# Altium project DIOT_tester.PrjPCB (part 3 of 3)

## Sheet LED_bargraph.SchDoc: LED
size 420 x 297 mm; Author: G.Kasprowicz; CompanyName: WUT ISE; DrawnBy: G.Kasprowicz; Organization: WUT ISE; Address1: PW ISE; Address2: Nowowiejska 15/19 00-665 Warsaw; Address3: gkasprow@gmail.com; Revision: 2; SheetNumber: -; SheetTotal: -; ModifiedBy: -; CheckedDate: -; Title2: Bargraph; DivGrp: WUT ISE; Designer: G.Kasprowicz; ModifiedDate: -; ProjectName: Sensor Box
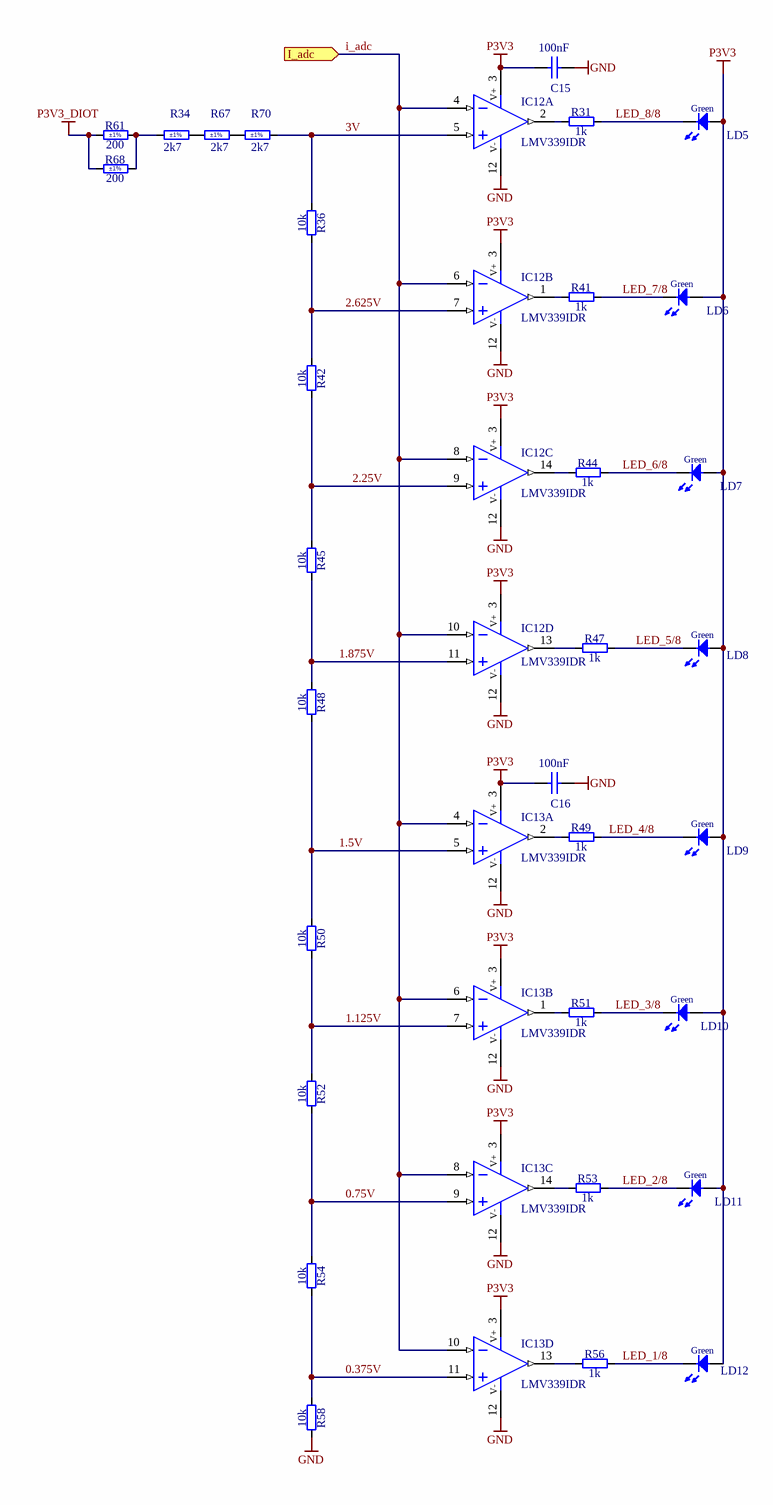
[diagram p6: LED_bargraph.SchDoc]

### Parts
C15  100nF  [CAPC1005X55N]
C16  100nF  [CAPC1005X55N]
IC12  LMV339IDR  [SOIC127P600X175-14N]  (parts A,B,C,D of 4)
IC13  LMV339IDR  [SOIC127P600X175-14N]  (parts A,B,C,D of 4)
LD5  Green  [LED_AVAGO_HSME-C120]
LD6  Green  [LED_AVAGO_HSME-C120]
LD7  Green  [LED_AVAGO_HSME-C120]
LD8  Green  [LED_AVAGO_HSME-C120]
LD9  Green  [LED_AVAGO_HSME-C120]
LD10  Green  [LED_AVAGO_HSME-C120]
LD11  Green  [LED_AVAGO_HSME-C120]
LD12  Green  [LED_AVAGO_HSME-C120]
R31  1k  [RESC1608X55N]
R34  2k7  Tolerance: ±1%  [RESC1608X55N]
R36  10k  [RESC1005X40N]
R41  1k  [RESC1608X55N]
R42  10k  [RESC1005X40N]
R44  1k  [RESC1608X55N]
R45  10k  [RESC1005X40N]
R47  1k  [RESC1608X55N]
R48  10k  [RESC1005X40N]
R49  1k  [RESC1608X55N]
R50  10k  [RESC1005X40N]
R51  1k  [RESC1608X55N]
R52  10k  [RESC1005X40N]
R53  1k  [RESC1608X55N]
R54  10k  [RESC1005X40N]
R56  1k  [RESC1608X55N]
R58  10k  [RESC1005X40N]
R61  200  Tolerance: ±1%  [RESC1005X40N]
R67  2k7  Tolerance: ±1%  [RESC1608X55N]
R68  200  Tolerance: ±1%  [RESC1005X40N]
R70  2k7  Tolerance: ±1%  [RESC1608X55N]

### Ports
I_adc (in)

### Nets
GND: C15.1 C16.1 IC12.12(V-) IC13.12(V-) R58.2
P3V3: C15.2 C16.2 IC12.3(V+) IC13.3(V+) LD5.2(A) LD6.2(A) LD7.2(A) LD8.2(A) LD9.2(A) LD10.2(A) LD11.2(A) LD12.2(A)
P3V3_DIOT: R61.1 R68.1
0.75V: IC13.9(IN+) R52.2 R54.1
0.375V: IC13.11(IN+) R54.2 R58.1
1.5V: IC13.5(IN+) R48.2 R50.1
1.125V: IC13.7(IN+) R50.2 R52.1
1.875V: IC12.11(IN+) R45.2 R48.1
2.25V: IC12.9(IN+) R42.2 R45.1
2.625V: IC12.7(IN+) R36.2 R42.1
3V: IC12.5(IN+) R36.1 R70.2
i_adc: IC12.4(IN-) IC12.6(IN-) IC12.8(IN-) IC12.10(IN-) IC13.4(IN-) IC13.6(IN-) IC13.8(IN-) IC13.10(IN-) ; port I_adc
LED_1/8: LD12.1(C) R56.2
LED_2/8: LD11.1(C) R53.2
LED_3/8: LD10.1(C) R51.2
LED_4/8: LD9.1(C) R49.2
LED_5/8: LD8.1(C) R47.2
LED_6/8: LD7.1(C) R44.2
LED_7/8: LD6.1(C) R41.2
LED_8/8: LD5.1(C) R31.2
NetIC12_1: IC12.1(OUT) R41.1
NetIC12_2: IC12.2(OUT) R31.1
NetIC12_13: IC12.13(OUT) R47.1
NetIC12_14: IC12.14(OUT) R44.1
NetIC13_1: IC13.1(OUT) R51.1
NetIC13_2: IC13.2(OUT) R49.1
NetIC13_13: IC13.13(OUT) R56.1
NetIC13_14: IC13.14(OUT) R53.1
NetR34_1: R34.1 R61.2 R68.2
NetR34_2: R34.2 R67.1
NetR67_2: R67.2 R70.1

### Notes on the sheet
- Project/Equipment
- Document
- Designer
- Drawn by
- Check.by
- Contact
- File
- Last Mod.
- Print Date
- Sheet
- Size
- A3
- of
- Rev
- Copyright WUT 2021.
  This document describes Open Hardware and is licensed under the CERN-OHL-W v2
  You may redistribute and modify this documentation and make products using it under the terms of the CERN-OHL-W v2 (https:/cern.ch/cern-ohl). This documentation is distributed WITHOUT ANY EXPRESS OR IMPLIED WARRANTY, INCLUDING OF MERCHANTABILITY, SATISFACTORY QUALITY AND FITNESS FOR A PARTICULAR PURPOSE. Please see the CERN-OHL-W v2 for applicable conditions.
  As per CERN-OHL-W v2 section 4, should You produce hardware based
  on these sources, You must maintain the Source Location visible on the
  silkscreen or top copper for a  product you make using this documentation..

### Library data of the parts
C15 C16 = CC0402_100NF_50V_10%_X7R: Non-polarised capacitor; Part Description: SMD Multilayer Chip Ceramic Capacitor; Manufacturer: GENERIC; Manufacturer1 Part Number: GRM155R71H104KE14D; Voltage: 50V; TC: X7R; Tolerance: ±10%; Part Number: CC0402_100NF_50V_10%_X7R; Component Kind: Standard; Component Type: Standard; Pin Count: 2; Value: 100nF; Status: None; Manufacturer Part Number: CC0402_100NF_50V_10%_X7R; Case: 0402; Mounted: Yes; Socket: No; SMD: Yes; Sense: No; HelpURL: \\cern.ch\dfs\Applications\Altium\Datasheets\CC0402_MURATA_GRM155R71H104KE14D.pdf; Author: CERN DEM MR; CreateDate: 30.06.2017; LatestRevisionDate: 30.06.2017; Manufacturer1 Example: MURATA; Manufacturer1 ComponentHeight: 0.55mm
IC12 IC13 = CMP_LMV339: Quad Differential Rail to Rail Comparator; Manufacturer: TEXAS INSTRUMENTS; PressFit: No; Bonding: No; Part Number: LMV339IDR; Component Kind: Standard; Component Type: Standard; Device: LMV339IDR; PackageDescription: SOIC 14, Pitch 1.27mm - Body 4x8.75mm, IPC Medium Density; Part Description: Quad Differential Rail to Rail Comparator; Manufacturer Part Number: LMV339IDR; Pin Count: 14; Case: SOIC14; Mounted: Yes; Socket: No; SMD: Yes; Sense: No; ComponentHeight: 1.75mm; Author: GK; HelpURL: \\cern.ch\dfs\Applications\Altium\Datasheets\LM339AD.pdf; CreateDate: 09.03.2011; LatestRevisionDate: 09.03.2011
LD5-LD12 = LED_AVAGO_HSME-C120: LED Green 1C 2A; Part Description: High Performance Right Angle Chip Green LED; Manufacturer: AVAGO TECHNOLOGIES; PressFit: No; Bonding: No; Part Number: LED_AVAGO_HSME-C120; Component Kind: Standard; Component Type: Standard; Color: Green; PackageDescription: Green Chip LED, 2-Leads, Body 1.7x1.1mm, Side Emitting Package; Manufacturer Part Number: HSME-C120; Pin Count: 2; Mounted: Yes; Socket: No; SMD: Yes; Sense: No; ComponentHeight: 0.7mm; HelpURL: \\cern.ch\dfs\Applications\Altium\Datasheets\LED_AVAGO_HSME-C120.pdf; ComponentLink1URL: \\cern.ch\dfs\Applications\Altium\Datasheets\LED_AVAGO_HSME-C110_DESIGN-GUIDE.pdf; ComponentLink1Description: Design Guide; Author: CERN DEM JMW; CreateDate: 22.07.2009; LatestRevisionDate: 20.06.2012
R31 R41 R44 R47 R49 R51 R53 R56 = R0603_1K_1%_0.1W_100PPM: Resistor - 1%; Part Description: General Purpose Thick Film Chip Resistor; Manufacturer: GENERIC; Manufacturer1 Part Number: NRC06F1001TRF; Power: 0.1W; TC: ±100ppm/°C; PressFit: No; Part Number: R0603_1K_1%_0.1W_100PPM; Component Kind: Standard; Component Type: Standard; Pin Count: 2; Value: 1k; Status: Preferred; Tolerance: ±1%; Manufacturer Part Number: R0603_1K_1%_0.1W_100PPM; Case: 0603; Mounted: Yes; Sense: No; Socket: No; SMD: Yes; Manufacturer1 Example: NIC COMPONENT; Manufacturer1 ComponentHeight: 0.55mm; HelpURL: \\cern.ch\dfs\Applications\Altium\Datasheets\R0603_NIC_NRC.pdf; Author: CERN DEM JLC; CreateDate: 03.12.2007; LatestRevisionDate: 13.03.2008
R34 R67 R70 = R0603_2K7_1%_0.1W_100PPM: Resistor - 1%; Part Description: General Purpose Thick Film Chip Resistor; Manufacturer: GENERIC; Manufacturer1 Part Number: RC0603FR-072K7L; Power: 0.1W; TC: ±100ppm/°C; PressFit: No; Part Number: R0603_2K7_1%_0.1W_100PPM; Component Kind: Standard; Component Type: Standard; Pin Count: 2; Value: 2k7; Status: Preferred; Manufacturer Part Number: R0603_2K7_1%_0.1W_100PPM; Case: 0603; Mounted: Yes; Sense: No; Socket: No; SMD: Yes; Manufacturer1 Example: YAGEO PHYCOMP; Manufacturer1 ComponentHeight: 0.55mm; HelpURL: \\cern.ch\dfs\Applications\Altium\Datasheets\R0603_PHYCOMP_RC0603.pdf; Author: CERN DEM JLC; CreateDate: 02.05.2011; LatestRevisionDate: 02.05.2011
R36 R42 R45 R48 R50 R52 R54 R58 = R0402_10K_1%_0.0625W_100PPM: Resistor - 1%; Part Description: General Purpose Thick Film Chip Resistor; Manufacturer: GENERIC; Manufacturer1 Part Number: 232270671003L; TC: ±100ppm/°C; PressFit: No; Part Number: R0402_10K_1%_0.0625W_100PPM; Component Kind: Standard; Component Type: Standard; Pin Count: 2; Value: 10k; Status: Not Recommended; Power: 0.0625W; Tolerance: ±1%; Manufacturer Part Number: R0402_10K_1%_0.0625W_100PPM; Case: 0402; Mounted: Yes; Sense: No; Socket: No; SMD: Yes; Manufacturer1 Example: YAGEO PHYCOMP; Manufacturer1 ComponentHeight: 0.4mm; HelpURL: \\cern.ch\dfs\Applications\Altium\Datasheets\R0402_Phycomp_RC0402.pdf; Author: CERN DEM JLC; CreateDate: 03.12.2007; LatestRevisionDate: 17.10.2012
R61 R68 = R0402_200R_1%_0.0625W_100PPM: Resistor - 1%; Part Description: General Purpose Thick Film Chip Resistor; Manufacturer: GENERIC; Manufacturer1 Part Number: 232270672001L; TC: ±100ppm/°C; PressFit: No; Part Number: R0402_200R_1%_0.0625W_100PPM; Component Kind: Standard; Component Type: Standard; Pin Count: 2; Value: 200; Status: Not Recommended; Power: 0.0625W; Manufacturer Part Number: R0402_200R_1%_0.0625W_100PPM; Case: 0402; Mounted: Yes; Sense: No; Socket: No; SMD: Yes; Manufacturer1 Example: YAGEO PHYCOMP; Manufacturer1 ComponentHeight: 0.4mm; HelpURL: \\cern.ch\dfs\Applications\Altium\Datasheets\R0402_Phycomp_RC0402.pdf; Author: CERN DEM JLC; CreateDate: 03.12.2007; LatestRevisionDate: 17.10.2012

## Sheet USB_ISOL.SchDoc: Isolated
size 420 x 297 mm; SPICEModelCacheMEOSHKXJ: <root> / <DocumentId>MEOSHKXJ</DocumentId> / <CacheFrame Number="0"> / <Model Name="pk14" Kind="CKT"> / <Text>*.INC dhvqfn.s / .SUBCKT pk14 / +    1   2   3   4   5   6   7   8   9  10 / +   11  12  13  14 / +   15  16  17  18  19  20  21  22  23  24 / +   25  26  27  28 / * Pin Resistance / r1 1 1001 9.078E-02 / r2 2 1002 8.829E-02 / r3 3 1003 8.731E-02 / r4 4 1004 8.710E-02 / r5 5 1005 8.731E-02 / r6 6 1006 8.829E-02 / r7 7 1007 9.075E-02 / r8 8 1008 9.072E-02 / r9 9 1009 8.809E-02 / r10 10 1010 8.716E-02 / r11 11 1011 8.706E-02 / r12 12 1012 8.720E-02 / r13 13 1013 8.816E-02 / r14 14 1014 9.068E-02 / * Pin Inductance / l1 1001 15 2.981E-09 / l2 1002 16 2.447E-09 / l3 1003 17 2.304E-09 / l4 1004 18 2.291E-09 / l5 1005 19 2.307E-09 / l6 1006 20 2.449E-09 / l7 1007 21 2.971E-09 / l8 1008 22 2.972E-09 / l9 1009 23 2.425E-09 / l10 1010 24 2.286E-09 / l11 1011 25 2.280E-09 / l12 1012 26 2.286E-09 / l13 1013 27 2.425E-09 / l14 1014 28 2.975E-09 / .ENDS pk14</Text> / </Model> / </CacheFrame> / </root>; Author: G.Kasprowicz; CompanyName: WUT ISE; DrawnBy: G.Kasprowicz; Organization: WUT ISE; Address1: PW ISE; Address2: Nowowiejska 15/19 00-665 Warsaw; Address3: gkasprow@gmail.com; Revision: 2; SheetNumber: -; SheetTotal: -; ModifiedBy: -; CheckedDate: -; Title2: USB to I2C interface; DivGrp: WUT ISE; Designer: G.Kasprowicz; ModifiedDate: -; ProjectName: Sensor Box
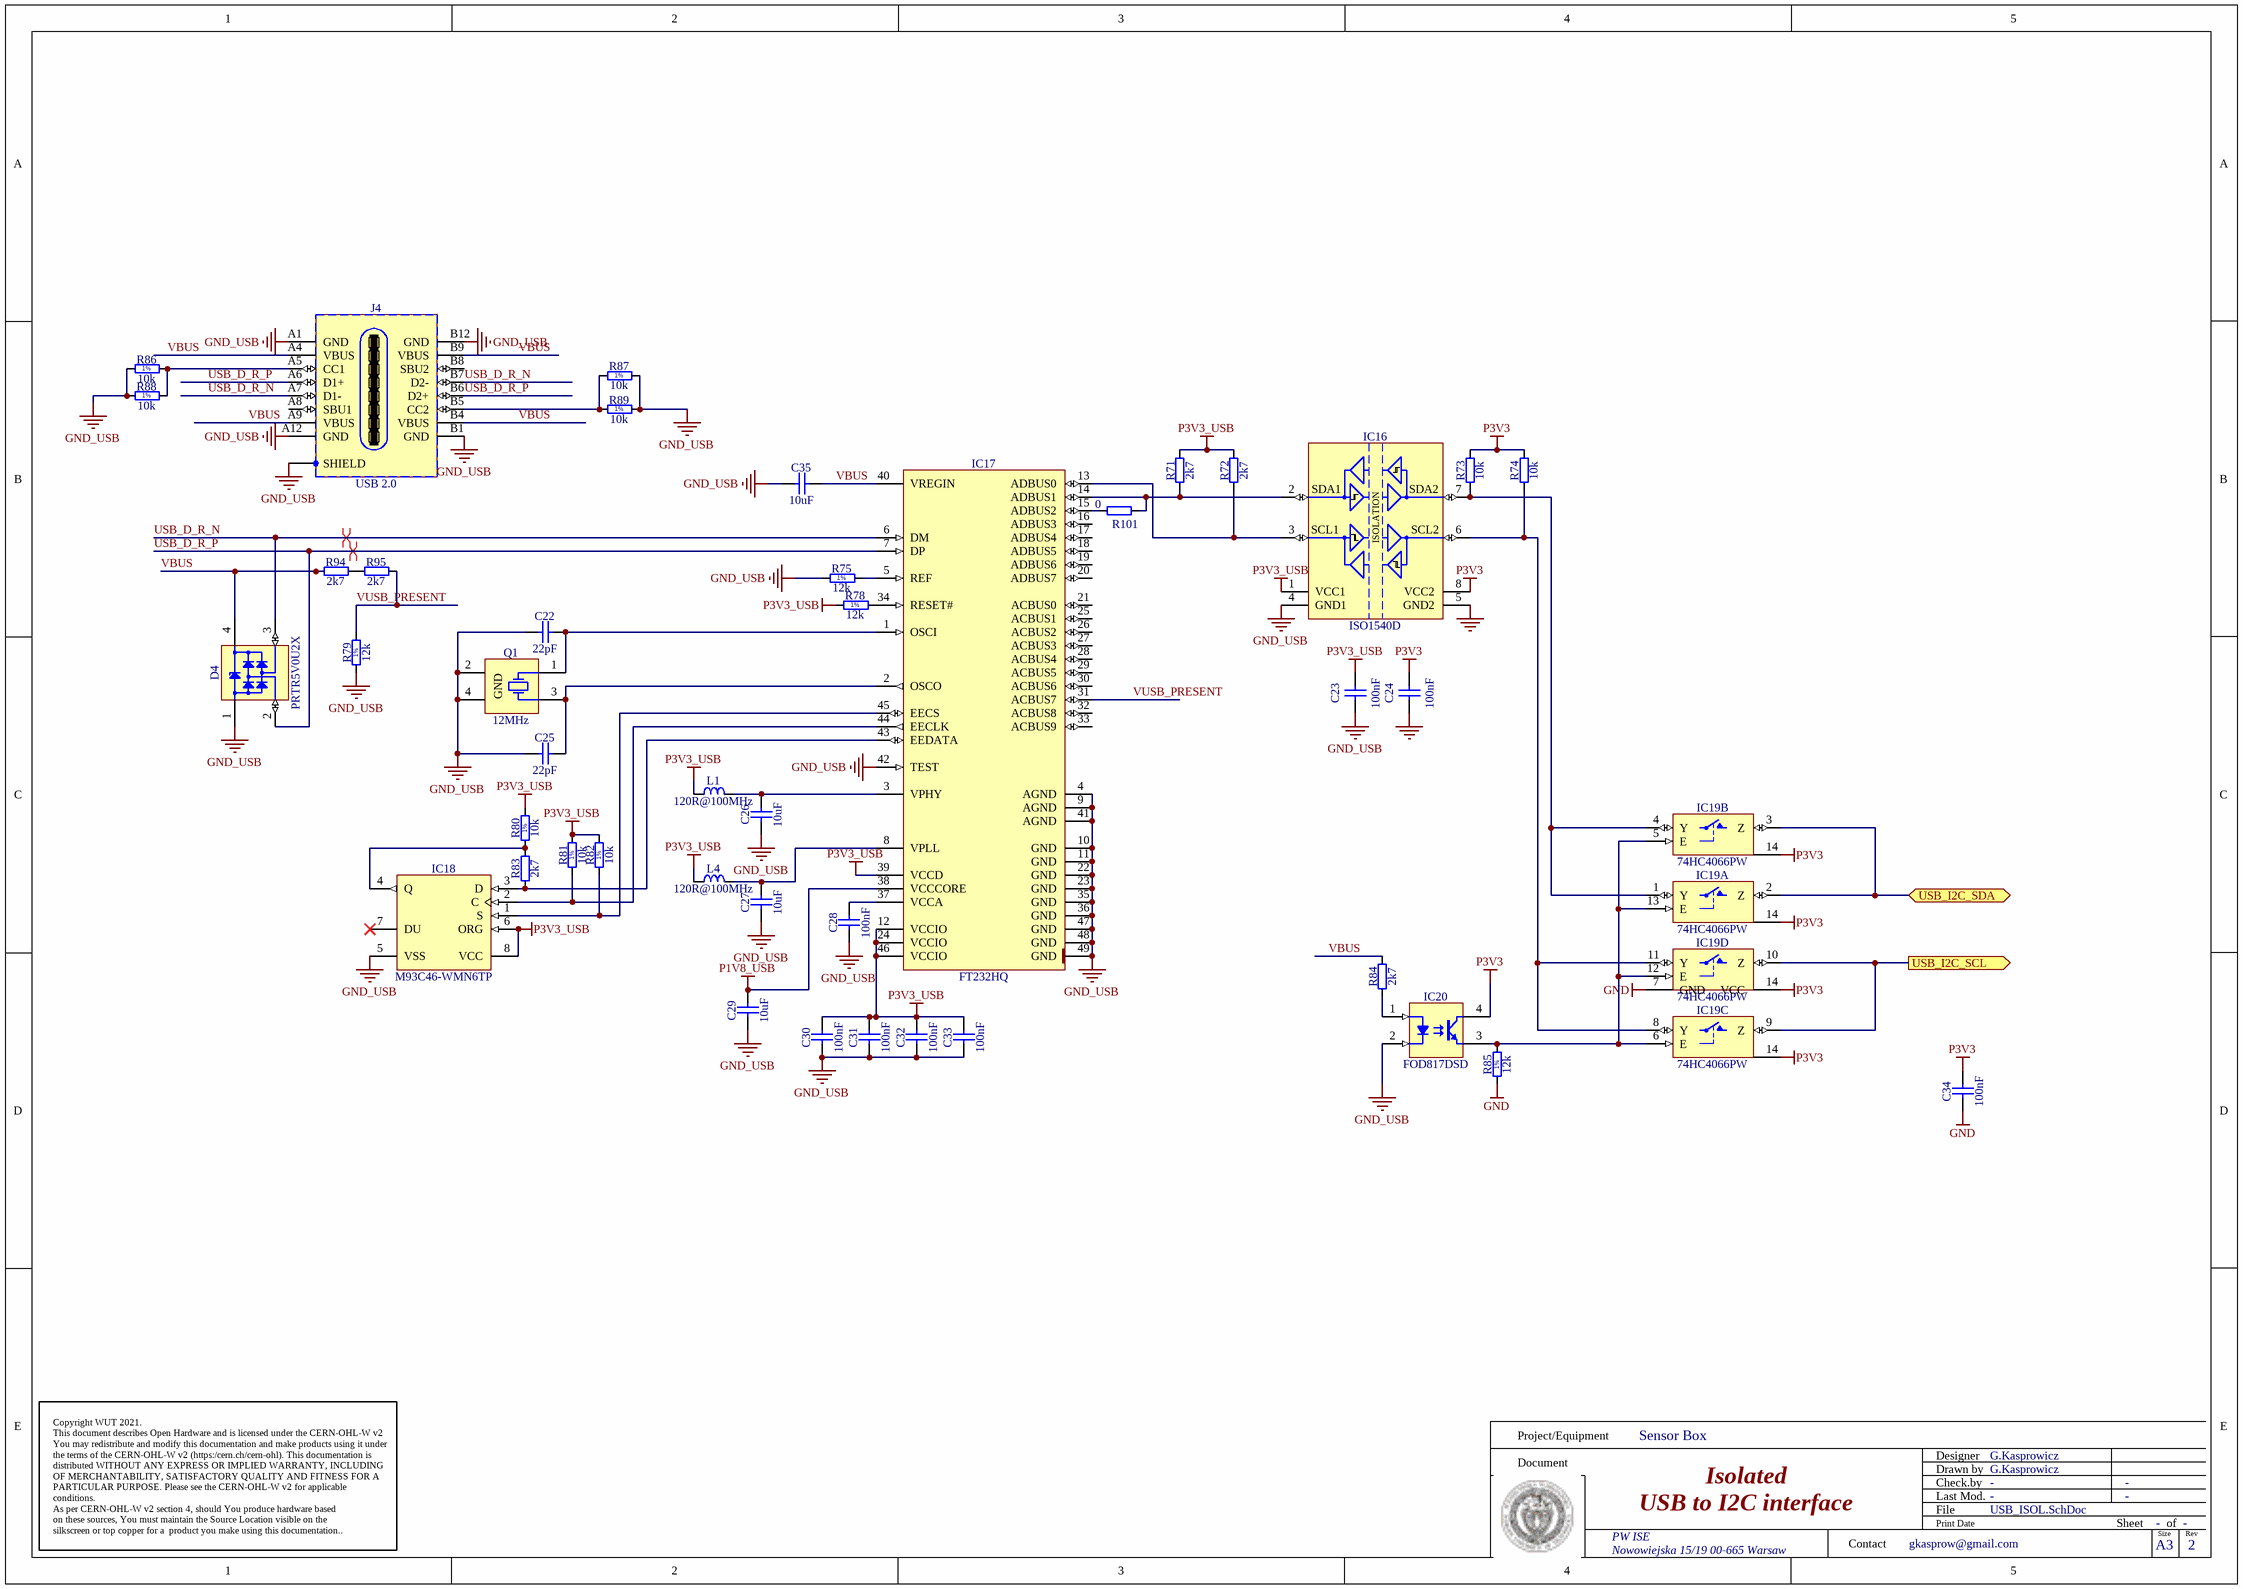
[diagram p7: USB_ISOL.SchDoc]

### Parts
C22  22pF  [CAPC1005X55N]
C23  100nF  [CAPC1005X55N]
C24  100nF  [CAPC1005X55N]
C25  22pF  [CAPC1005X55N]
C26  10uF  [CAPC2012X95N]
C27  10uF  [CAPC2012X95N]
C28  100nF  [CAPC1005X55N]
C29  10uF  [CAPC2012X95N]
C30  100nF  [CAPC1005X55N]
C31  100nF  [CAPC1005X55N]
C32  100nF  [CAPC1005X55N]
C33  100nF  [CAPC1005X55N]
C34  100nF  [CAPC1005X55N]
C35  10uF  [CAPC2012X95N]
D4  PRTR5V0U2X  [SOT190P230X110-4N]
IC16  ISO1540D  [SOIC127P600X175-8N]
IC17  FT232HQ  [QFN50P800X800X90-49N-S625]
IC18  M93C46-WMN6TP  [SOIC127P600X175-8N]
IC19  74HC4066PW  [SOP65P640X110-14N]  (parts A,B,C,D of 4)
IC20  FOD817DSD  [FAIRCHILD_FOD817DSD]
J4  USB 2.0  [GCT_USB4105-GF-A]
L1  120R@100MHz  [INDC1608X65N]
L4  120R@100MHz  [INDC1608X65N]
Q1  12MHz  [XTAL_TXC_7M]
R71  2k7  [RESC1608X55N]
R72  2k7  [RESC1608X55N]
R73  10k  [RESC1005X40N]
R74  10k  [RESC1005X40N]
R75  12k  [RESC1005X40N]
R78  12k  [RESC1005X40N]
R79  12k  [RESC1005X40N]
R80  10k  [RESC1005X40N]
R81  10k  [RESC1005X40N]
R82  10k  [RESC1005X40N]
R83  2k7  [RESC1608X55N]
R84  2k7  [RESC1608X55N]
R85  12k  [RESC1005X40N]
R86  10k  [RESC1005X40N]
R87  10k  [RESC1005X40N]
R88  10k  [RESC1005X40N]
R89  10k  [RESC1005X40N]
R94  2k7  [RESC1608X55N]
R95  2k7  [RESC1608X55N]
R101  0  [RESC1005X40N]

### Ports
USB_I2C_SCL (out), USB_I2C_SDA (bidir)

### Nets
GND: C24.1 C34.1 IC16.5(GND2) IC19.7(GND) R85.1
GND_USB: C22.1 C23.1 C25.1 C26.1 C27.1 C28.1 C29.1 C30.1 C31.1 C32.1 C33.1 C35.1 D4.1(GND) IC16.4(GND1) IC17.4(AGND) IC17.9(AGND) IC17.10(GND) IC17.11(GND) IC17.22(GND) IC17.23(GND) IC17.35(GND) IC17.36(GND) IC17.41(AGND) IC17.42(TEST) IC17.47(GND) IC17.48(GND) IC17.49(GND) IC18.5(VSS) IC20.2(C) J4.A1(GND) J4.A12(GND) J4.B1(GND) J4.B12(GND) J4.SHIELD Q1.2(GND) Q1.4(GND) R75.1 R79.1 R86.1 R87.2 R88.1 R89.2
P1V8_USB: C29.2 IC17.38(VCCCORE)
P3V3: C24.2 C34.2 IC16.8(VCC2) IC19.14(VCC) IC20.4(C) R73.2 R74.2
P3V3_USB: C23.2 C30.2 C31.2 C32.2 C33.2 IC16.1(VCC1) IC17.12(VCCIO) IC17.24(VCCIO) IC17.39(VCCD) IC17.46(VCCIO) IC18.6(ORG) IC18.8(VCC) L1.1 L4.1 R71.2 R72.2 R78.1 R80.2 R81.2 R82.2
EEM0_I2C.SCL: IC19.9(Z) IC19.10(Z) ; port USB_I2C_SCL
EEM0_I2C.SDA: IC19.2(Z) IC19.3(Z) ; port USB_I2C_SDA
USB_D_R_N: D4.3(I/O2) IC17.6(DM) J4.A7(D1-) J4.B7(D2-)
USB_D_R_P: D4.2(I/O1) IC17.7(DP) J4.A6(D1+) J4.B6(D2+)
VBUS: C35.2 D4.4(VCC) IC17.40(VREGIN) J4.A4(VBUS) J4.A9(VBUS) J4.B4(VBUS) J4.B9(VBUS) R84.1 R94.1
VUSB_PRESENT: IC17.31(ACBUS7) R79.2 R95.2
NetC22_2: C22.2 IC17.1(OSCI) Q1.1(X)
NetC25_2: C25.2 IC17.2(OSCO) Q1.3(X)
NetC26_2: C26.2 IC17.3(VPHY) L1.2
NetC27_2: C27.2 IC17.8(VPLL) L4.2
NetC28_2: C28.2 IC17.37(VCCA)
NetIC16_2: IC16.2(SDA1) IC17.14(ADBUS1) R71.1 R101.2
NetIC16_3: IC16.3(SCL1) IC17.13(ADBUS0) R72.1
NetIC16_6: IC16.6(SCL2) IC19.8(Y) IC19.11(Y) R74.1
NetIC16_7: IC16.7(SDA2) IC19.1(Y) IC19.4(Y) R73.1
NetIC17_5: IC17.5(REF) R75.2
NetIC17_15: IC17.15(ADBUS2) R101.1
NetIC17_34: IC17.34(RESET#) R78.2
NetIC17_43: IC17.43(EEDATA) IC18.3(D) R83.2
NetIC17_44: IC17.44(EECLK) IC18.2(C) R81.1
NetIC17_45: IC17.45(EECS) IC18.1(S) R82.1
NetIC18_4: IC18.4(Q) R80.1 R83.1
NetIC19_5: IC19.5(E) IC19.6(E) IC19.12(E) IC19.13(E) IC20.3(E) R85.2
NetIC20_1: IC20.1(A) R84.2
NetJ4_A5: J4.A5(CC1) R86.2 R88.2
NetJ4_B5: J4.B5(CC2) R87.1 R89.1
NetR94_2: R94.2 R95.1

Not connected (* = marked no-connect by the designer): IC17 16(ADBUS3) 17(ADBUS4) 18(ADBUS5) 19(ADBUS6) 20(ADBUS7) 21(ACBUS0) 25(ACBUS1) 26(ACBUS2) 27(ACBUS3) 28(ACBUS4) 29(ACBUS5) 30(ACBUS6) 32(ACBUS8) 33(ACBUS9); IC18 7(DU)*; J4 A8(SBU1) B8(SBU2)

### Layout directives
differential pair; differential pair class Diff_90Ohm: USB_D_R_N, USB_D_R_P

### Notes on the sheet
- Project/Equipment
- Document
- Designer
- Drawn by
- Check.by
- Contact
- File
- Last Mod.
- Print Date
- Sheet
- Size
- A3
- of
- Rev
- Copyright WUT 2021.
  This document describes Open Hardware and is licensed under the CERN-OHL-W v2
  You may redistribute and modify this documentation and make products using it under the terms of the CERN-OHL-W v2 (https:/cern.ch/cern-ohl). This documentation is distributed WITHOUT ANY EXPRESS OR IMPLIED WARRANTY, INCLUDING OF MERCHANTABILITY, SATISFACTORY QUALITY AND FITNESS FOR A PARTICULAR PURPOSE. Please see the CERN-OHL-W v2 for applicable conditions.
  As per CERN-OHL-W v2 section 4, should You produce hardware based
  on these sources, You must maintain the Source Location visible on the
  silkscreen or top copper for a  product you make using this documentation..
- (in symbol ISO1540D) ISOLATION
- (in symbol R0402_10K_1%_0.0625W_100PPM) 1%
- (in symbol R0402_12K_1%_0.0625W_100PPM) 1%

### Library data of the parts
C22 C25 = CC0402_22PF_50V_5%_C0G: Non-polarised capacitor; Part Description: SMD Multilayer Chip Ceramic Capacitor; Manufacturer: GENERIC; Manufacturer1 Part Number: C0402C220J5GACTU; Voltage: 50V; TC: C0G/NP0; Tolerance: ±5%; Part Number: CC0402_22PF_50V_5%_C0G; Component Kind: Standard; Component Type: Standard; Pin Count: 2; Value: 22pF; Status: Preferred; Manufacturer Part Number: CC0402_22PF_50V_5%_C0G; Case: 0402; Mounted: Yes; Socket: No; SMD: Yes; Sense: No; Manufacturer1 Example: KEMET; Manufacturer1 ComponentHeight: 0.55mm; HelpURL: \\cern.ch\dfs\Applications\Altium\Datasheets\CC0805_C0G_KEMET_(Commercial Grade).pdf; Author: CERN DEM JLC; CreateDate: 03.12.2007; LatestRevisionDate: 03.12.2007
C23 C24 C28 C30-C34 = CC0402_100NF_50V_10%_X7R: as C15 on sheet LED_bargraph; Part Number: CC0402_100NF_50V_10%_X7R; Component Kind: Standard; Component Type: Standard; Pin Count: 2; Value: 100nF; Status: None; Manufacturer Part Number: CC0402_100NF_50V_10%_X7R; Case: 0402; Mounted: Yes; Socket: No; SMD: Yes; Sense: No; Manufacturer1 Example: MURATA; Manufacturer1 ComponentHeight: 0.55mm; HelpURL: \\cern.ch\dfs\Applications\Altium\Datasheets\CC0402_MURATA_GRM155R71H104KE14D.pdf; Author: CERN DEM MR; CreateDate: 30.06.2017; LatestRevisionDate: 30.06.2017
C26 C27 C29 C35 = CC0805_10UF_25V_10%_X5R: Non-polarised capacitor; Part Description: SMD Multilayer Chip Ceramic Capacitor; Manufacturer: GENERIC; Manufacturer1 Part Number: GRM219R61E106KA12D; Voltage: 25V; TC: X5R; Tolerance: ±10%; Part Number: CC0805_10UF_25V_10%_X5R; Component Kind: Standard; Component Type: Standard; Pin Count: 2; Value: 10uF; Status: Preferred; Manufacturer Part Number: CC0805_10UF_25V_10%_X5R; Case: 0805; Mounted: Yes; Socket: No; SMD: Yes; Sense: No; Manufacturer1 Example: MURATA; Manufacturer1 ComponentHeight: 0.95mm; HelpURL: \\cern.ch\dfs\Applications\Altium\Datasheets\CC0805_X5R_MURATA_GRM.pdf; Author: CERN DEM JLC; CreateDate: 25.10.2012; LatestRevisionDate: 06.09.2016
D4 = PRTR5V0U2X: Ultra Low Capacitance Double Rail-to-Rail ESD Protection Diode; Part Description: Ultra Low Capacitance (1pF) Double Rail-to-Rail ESD Protection Diode (8kV); Manufacturer: NXP SEMICONDUCTORS; Voltage: 5.5V; PressFit: No; Bonding: No; Part Number: PRTR5V0U2X; Component Kind: Standard; Component Type: Standard; Device: PRTR5V0U2X; PackageDescription: SOT143B, SOT, 1.90mm Pitch; 4 Pin, 1.30mm W X 2.90mm L X 1.10mm H body, IPC Medium Density; Manufacturer Part Number: PRTR5V0U2X; Pin Count: 4; Case: SOT143B; Mounted: Yes; Socket: No; SMD: Yes; Sense: No; ComponentHeight: 1.1mm; HelpURL: \\cern.ch\dfs\Applications\Altium\Datasheets\PRTR5V0U2X.pdf; Author: CERN DEM JLC; CreateDate: 22.03.2011; LatestRevisionDate: 22.03.2011
IC16 = ISO1540D: Low-Power Bi-Directional I2C Isolator; Manufacturer: TEXAS INSTRUMENTS; PressFit: No; Bonding: No; Part Number: ISO1540D; Component Kind: Standard; Component Type: Standard; Device: ISO1540D; PackageDescription: SOIC 8, Pitch 1.27mm - Body 4x5mm, IPC Medium Density; Part Description: Low-Power Bi-Directional I2C Isolator; Manufacturer Part Number: ISO1540D; Pin Count: 8; Case: SOIC8; Mounted: Yes; Socket: No; SMD: Yes; Sense: No; ComponentHeight: 1.75mm; Author: CERN DEM JLC; HelpURL: \\cern.ch\dfs\Applications\Altium\Datasheets\ISO1540D.pdf; CreateDate: 21.11.2013; LatestRevisionDate: 21.11.2013
IC17 = FT232HQ: Single channel High Speed USB To Multipurpose UART/FIFO IC; Manufacturer: FUTURE TECHNOLOGY DEVICES INTERNATIONAL (FTDI); PressFit: No; Bonding: No; Part Number: FT232HQ; Component Kind: Standard; Component Type: Standard; Device: FT232HQ; PackageDescription: QFN, 0.50mm Pitch, Square; 48 Pin, 8.00mm L X 8.00mm W X 0.90mm H body (w/Thermal Tab 6.25 X 6.25mm), IPC Medium Density; Part Description: Single Channel High Speed USB To Multipurpose UART/FIFO IC; Manufacturer Part Number: FT232HQ; Pin Count: 49; Case: QFN48; Mounted: Yes; Socket: No; SMD: Yes; Sense: No; ComponentHeight: 0.9mm; Author: CERN DEM BC; HelpURL: \\cern.ch\dfs\Applications\Altium\Datasheets\FT232HQ.pdf; CreateDate: 20.01.2021; LatestRevisionDate: 20.01.2021
IC18 = M93C46-WMN6TP: 2.5 to 5.5 V, 1Kb (128x8) Serial Microwire Bus EEPROM; Part Description: 1Kbit (128 x 8 bit or 64 x 16 bit) MICROWIRE® Serial Access EEPROM; Manufacturer: ST MICROELECTRONICS; PressFit: No; Bonding: No; Part Number: M93C46-WMN6TP; Component Kind: Standard; Component Type: Standard; Device: M93C46-WMN6TP; PackageDescription: SOIC 8, Pitch 1.27mm - Body 4x5mm, IPC Medium Density; Manufacturer Part Number: M93C46-WMN6TP; Pin Count: 8; Case: SOIC8; Mounted: Yes; Socket: No; SMD: Yes; Sense: No; ComponentHeight: 1.75mm; HelpURL: \\cern.ch\dfs\Applications\Altium\Datasheets\M93C46-WMN6TP.pdf; Author: CERN DEM JLC; CreateDate: 15.11.2012; LatestRevisionDate: 15.11.2012
IC19 = 74HC4066PW: Part Description: Quad Single-Pole Single-Throw Analog Switch; Manufacturer: NXP SEMICONDUCTORS; PressFit: No; Bonding: No; Table: Standard Logic; Part Number: 74HC4066PW; Component Kind: Standard; Component Type: Standard; Device: 74HC4066PW; PackageDescription: SOP, 14-Leads, Body 4.4x5mm (max), Pitch 0.65mm, IPC Medium Density; Manufacturer Part Number: 74HC4066PW; Pin Count: 14; Case: TSSOP14; Mounted: Yes; Socket: No; SMD: Yes; ComponentHeight: 1.1mm; Author: CERN DEM JLC; HelpURL: \\cern.ch\dfs\Applications\Altium\Datasheets\74HC4066PW.pdf; CreateDate: 2014-11-19; LatestRevisionDate: 2014-11-19
IC20 = FOD817DSD: Single Optocoupler; Part Description: 4-Pin High Operating Temperature Phototransistor Optocoupler; Manufacturer: FAIRCHILD SEMICONDUCTOR; PressFit: No; Bonding: No; Part Number: FOD817DSD; Component Kind: Standard; Component Type: Standard; Device: FOD817DSD; PackageDescription: SOIC, 2.54mm Pitch; 4 Pin, 6.50mm W X 4.60mm L X 4.60mm H body; Manufacturer Part Number: FOD817DSD; Pin Count: 4; Case: SOIC4; Mounted: Yes; Socket: No; SMD: Yes; Sense: No; ComponentHeight: 4.6mm; HelpURL: \\cern.ch\dfs\Applications\Altium\Datasheets\FOD817DSD.pdf; Author: CERN DEM JLC; CreateDate: 21.07.2014; LatestRevisionDate: 21.07.2014
J4 = GCT_USB4105-GF-A: 2x8 Pin + 1 Shield  USB Type C Receptacle; Part Description: USB 2.0 Type C Receptacle 16 Contacts, SMD, horizontal; Manufacturer: GCT; PressFit: No; Part Number: GCT_USB4105-GF-A; Component Kind: Standard; Component Type: Standard; Pin Count: 20; Family: USB 2.0; Mounted: Yes; Socket: No; SMD: Yes; Sense: No; Status: None; Manufacturer Part Number: USB4105-GF-A; ComponentHeight: 3.31mm; HelpURL: \\cern.ch\dfs\Applications\Altium\Datasheets\GCT_USB4105-GF-A.pdf; Author: CERN DEM HF; CreateDate: 12.10.2023; LatestRevisionDate: 12.10.2023
L1 L4 = IND0603_MURATA_BLM18SG121TN1D: Inductor; Part Description: SMD EMIFIL Suppression Chip Ferrite Bead; Manufacturer: MURATA; Power: 3A; Resistance: 0.025R; Tolerance: ±25%; Part Number: IND0603_MURATA_BLM18SG121TN1D; Component Kind: Standard; Component Type: Standard; Pin Count: 2; Value: 120R@100MHz; Status: None; Manufacturer Part Number: BLM18SG121TN1D; Case: 0603; Mounted: Yes; Socket: No; SMD: Yes; Sense: No; ComponentHeight: 0.65mm; HelpURL: \\cern.ch\dfs\Applications\Altium\Datasheets\IND0603_MURATA_BLM18S.pdf; Author: CERN DEM JLC; CreateDate: 23.07.2014; LatestRevisionDate: 23.07.2014
Q1 = XTAL_12MHZ_TXC_7M-12.000MAAJ-T: Crystal 4 pins 1=XTAL Control 2=GND3=XTAL 4=GND; Part Description: ±30ppm 18pF -20°C to +70°C  4 Pins, 3.2x2.5X0.8mm, SMD Sealing Crystal, 7M Series; Manufacturer: TXC CORPORATION; PressFit: No; Bonding: No; Part Number: XTAL_12MHZ_TXC_7M-12.000MAAJ-T; Component Kind: Standard; Component Type: Standard; PackageDescription: 4 Pins, 2.5x3.2mm, SMD Sealing Crystal, 7M Serie; Value: 12MHz; Manufacturer Part Number: 7M-12.000MAAJ-T; Pin Count: 4; Mounted: Yes; Socket: No; SMD: Yes; Sense: No; ComponentHeight: 0.8mm; HelpURL: \\cern.ch\dfs\Applications\Altium\Datasheets\XTAL_TXC_7M.pdf; Author: CERN DEM JLC; CreateDate: 19.06.2012; LatestRevisionDate: 19.06.2012
R71 R72 R83 R84 R94 R95 = R0603_2K7_1%_0.1W_100PPM: as R34 on sheet LED_bargraph; Part Number: R0603_2K7_1%_0.1W_100PPM; Component Kind: Standard; Component Type: Standard; Pin Count: 2; Value: 2k7; Status: Preferred; Tolerance: ±1%; Manufacturer Part Number: R0603_2K7_1%_0.1W_100PPM; Case: 0603; Mounted: Yes; Sense: No; Socket: No; SMD: Yes; Manufacturer1 Example: YAGEO PHYCOMP; Manufacturer1 ComponentHeight: 0.55mm; HelpURL: \\cern.ch\dfs\Applications\Altium\Datasheets\R0603_PHYCOMP_RC0603.pdf; Author: CERN DEM JLC; CreateDate: 02.05.2011; LatestRevisionDate: 02.05.2011
R73 R74 R80-R82 R86-R89 = R0402_10K_1%_0.0625W_100PPM: as R36 on sheet LED_bargraph; Part Number: R0402_10K_1%_0.0625W_100PPM; Component Kind: Standard; Component Type: Standard; Pin Count: 2; Value: 10k; Status: Not Recommended; Power: 0.0625W; Tolerance: ±1%; Manufacturer Part Number: R0402_10K_1%_0.0625W_100PPM; Case: 0402; Mounted: Yes; Sense: No; Socket: No; SMD: Yes; Manufacturer1 Example: YAGEO PHYCOMP; Manufacturer1 ComponentHeight: 0.4mm; HelpURL: \\cern.ch\dfs\Applications\Altium\Datasheets\R0402_Phycomp_RC0402.pdf; Author: CERN DEM JLC; CreateDate: 03.12.2007; LatestRevisionDate: 17.10.2012
R75 R78 R79 R85 = R0402_12K_1%_0.0625W_100PPM: Resistor - 1%; Part Description: General Purpose Thick Film Chip Resistor; Manufacturer: GENERIC; Manufacturer1 Part Number: 232270671203L; TC: ±100ppm/°C; PressFit: No; Part Number: R0402_12K_1%_0.0625W_100PPM; Component Kind: Standard; Component Type: Standard; Pin Count: 2; Value: 12k; Status: Not Recommended; Power: 0.0625W; Tolerance: ±1%; Manufacturer Part Number: R0402_12K_1%_0.0625W_100PPM; Case: 0402; Mounted: Yes; Sense: No; Socket: No; SMD: Yes; Manufacturer1 Example: YAGEO PHYCOMP; Manufacturer1 ComponentHeight: 0.4mm; HelpURL: \\cern.ch\dfs\Applications\Altium\Datasheets\R0402_Phycomp_RC0402.pdf; Author: CERN DEM JLC; CreateDate: 03.12.2007; LatestRevisionDate: 17.10.2012
R101 = R0402_0R_JUMPER: Resistor; Part Description: 1A (0.05R Max DC Resistance) Zero Ohm Jumper; Manufacturer: GENERIC; Manufacturer1 Part Number: 232270591001L; Part Number: R0402_0R_JUMPER; Component Kind: Standard; Component Type: Standard; Pin Count: 2; Value: 0; Status: Not recommended; Manufacturer Part Number: R0402_0R_JUMPER; Case: 0402; Mounted: Yes; Sense: No; Socket: No; SMD: Yes; Manufacturer1 Example: YAGEO PHYCOMP; Manufacturer1 ComponentHeight: 0.4mm; HelpURL: \\cern.ch\dfs\Applications\Altium\Datasheets\R0402_Phycomp_RC0402.pdf; Author: CERN DEM JLC; CreateDate: 03.12.2007; LatestRevisionDate: 17.10.2012

## Nets that join several sheets
GND: DIOT_tester (40 pins), Power_Supplies (45 pins), CPCIS_Connectors_P1_P6 (66 pins), EEM_Connectors (35 pins), CLK_GEN (J1.2 TR1.6), U_Heater_Thermometer0 (8 pins), U_Heater_Thermometer1 (7 pins), U_Heater_Thermometer2 (7 pins), U_Heater_Thermometer3 (6 pins), U_Heater_Thermometer4 (7 pins), U_Heater_Thermometer5 (6 pins), U_Heater_Thermometer6 (6 pins), U_Heater_Thermometer7 (5 pins), U_Heater_Thermometer8 (8 pins), U_Heater_Thermometer9 (7 pins), U_Heater_Thermometer10 (7 pins), U_Heater_Thermometer11 (6 pins), U_Heater_Thermometer12 (7 pins), U_Heater_Thermometer13 (6 pins), U_Heater_Thermometer14 (6 pins), U_Heater_Thermometer15 (5 pins), LED_bargraph (5 pins), USB_ISOL (5 pins)
P3V3: DIOT_tester (C20.2 LD13.2 R63.2 R64.2), Power_Supplies (5 pins), LED_bargraph (12 pins), USB_ISOL (7 pins)
P3V3_DIOT: DIOT_tester (21 pins), Power_Supplies (5 pins), CPCIS_Connectors_P1_P6 (13 pins), EEM_Connectors (C298.2 IC40.14), U_Heater_Thermometer0 (C14A.2 IC11A.8), U_Heater_Thermometer1 (C14B.2 IC11B.7 IC11B.8), U_Heater_Thermometer2 (C14C.2 IC11C.6 IC11C.8), U_Heater_Thermometer3 (C14D.2 IC11D.6 IC11D.7 IC11D.8), U_Heater_Thermometer4 (C14E.2 IC11E.5 IC11E.8), U_Heater_Thermometer5 (C14F.2 IC11F.5 IC11F.7 IC11F.8), U_Heater_Thermometer6 (C14G.2 IC11G.5 IC11G.6 IC11G.8), U_Heater_Thermometer7 (5 pins), U_Heater_Thermometer8 (C14I.2 IC11I.8), U_Heater_Thermometer9 (C14J.2 IC11J.7 IC11J.8), U_Heater_Thermometer10 (C14K.2 IC11K.6 IC11K.8), U_Heater_Thermometer11 (C14L.2 IC11L.6 IC11L.7 IC11L.8), U_Heater_Thermometer12 (C14M.2 IC11M.5 IC11M.8), U_Heater_Thermometer13 (C14N.2 IC11N.5 IC11N.7 IC11N.8), U_Heater_Thermometer14 (C14O.2 IC11O.5 IC11O.6 IC11O.8), U_Heater_Thermometer15 (5 pins), LED_bargraph (R61.1 R68.1)
P3V3_MP: Power_Supplies (11 pins), EEM_Connectors (5 pins)
P12V0: Power_Supplies (8 pins), EEM_Connectors (12 pins)
P12V0_DIOT: Power_Supplies (C40.2 IC14.1 IC14.3), CPCIS_Connectors_P1_P6 (7 pins), EEM_Connectors (8 pins)
P12V0H: DIOT_tester (C17.2 R90.2), Power_Supplies (8 pins), U_Heater_Thermometer0 (C13A.2 LD3A.2 R25A.2 R26A.2), U_Heater_Thermometer1 (C13B.2 LD3B.2 R25B.2 R26B.2), U_Heater_Thermometer2 (C13C.2 LD3C.2 R25C.2 R26C.2), U_Heater_Thermometer3 (C13D.2 LD3D.2 R25D.2 R26D.2), U_Heater_Thermometer4 (C13E.2 LD3E.2 R25E.2 R26E.2), U_Heater_Thermometer5 (C13F.2 LD3F.2 R25F.2 R26F.2), U_Heater_Thermometer6 (C13G.2 LD3G.2 R25G.2 R26G.2), U_Heater_Thermometer7 (C13H.2 LD3H.2 R25H.2 R26H.2), U_Heater_Thermometer8 (C13I.2 LD3I.2 R25I.2 R26I.2), U_Heater_Thermometer9 (C13J.2 LD3J.2 R25J.2 R26J.2), U_Heater_Thermometer10 (C13K.2 LD3K.2 R25K.2 R26K.2), U_Heater_Thermometer11 (C13L.2 LD3L.2 R25L.2 R26L.2), U_Heater_Thermometer12 (C13M.2 LD3M.2 R25M.2 R26M.2), U_Heater_Thermometer13 (C13N.2 LD3N.2 R25N.2 R26N.2), U_Heater_Thermometer14 (C13O.2 LD3O.2 R25O.2 R26O.2), U_Heater_Thermometer15 (C13P.2 LD3P.2 R25P.2 R26P.2)
BP_I2C.SCL: CPCIS_Connectors_P1_P6 (D5.3 J6.B2), EEM_Connectors (R77.1)
BP_I2C.SDA: CPCIS_Connectors_P1_P6 (D5.1 J6.C2), EEM_Connectors (R3.1)
BP_IO.LVDS_N0: CPCIS_Connectors_P1_P6 (J6.E3), EEM_Connectors (R161.1)
BP_IO.LVDS_N1: CPCIS_Connectors_P1_P6 (J6.B3), EEM_Connectors (R162.1)
BP_IO.LVDS_N2: CPCIS_Connectors_P1_P6 (J6.C4), EEM_Connectors (R163.1)
BP_IO.LVDS_N3: CPCIS_Connectors_P1_P6 (J6.L4), EEM_Connectors (R164.1)
BP_IO.LVDS_N4: CPCIS_Connectors_P1_P6 (J6.I4), EEM_Connectors (R167.1)
BP_IO.LVDS_N5: CPCIS_Connectors_P1_P6 (J6.K5), EEM_Connectors (R168.1)
BP_IO.LVDS_N6: CPCIS_Connectors_P1_P6 (J6.H5), EEM_Connectors (R169.1)
BP_IO.LVDS_N7: CPCIS_Connectors_P1_P6 (J6.F6), EEM_Connectors (R170.1)
BP_IO.LVDS_N8: CPCIS_Connectors_P1_P6 (J6.C6), EEM_Connectors (R171.1)
BP_IO.LVDS_N9: CPCIS_Connectors_P1_P6 (J6.L6), EEM_Connectors (R172.1)
BP_IO.LVDS_N10: CPCIS_Connectors_P1_P6 (J6.I6), EEM_Connectors (R173.1)
BP_IO.LVDS_N11: CPCIS_Connectors_P1_P6 (J7.E1), EEM_Connectors (R174.1)
BP_IO.LVDS_N12: CPCIS_Connectors_P1_P6 (J7.B1), EEM_Connectors (R175.1)
BP_IO.LVDS_N13: CPCIS_Connectors_P1_P6 (J7.K1), EEM_Connectors (R176.1)
BP_IO.LVDS_N14: CPCIS_Connectors_P1_P6 (J7.H1), EEM_Connectors (R177.1)
BP_IO.LVDS_N15: CPCIS_Connectors_P1_P6 (J6.F2), EEM_Connectors (R144.2)
BP_IO.LVDS_P0: CPCIS_Connectors_P1_P6 (J6.D3), EEM_Connectors (R145.1)
BP_IO.LVDS_P1: CPCIS_Connectors_P1_P6 (J6.A3), EEM_Connectors (R146.1)
BP_IO.LVDS_P2: CPCIS_Connectors_P1_P6 (J6.B4), EEM_Connectors (R147.1)
BP_IO.LVDS_P3: CPCIS_Connectors_P1_P6 (J6.K4), EEM_Connectors (R148.1)
BP_IO.LVDS_P4: CPCIS_Connectors_P1_P6 (J6.H4), EEM_Connectors (R149.1)
BP_IO.LVDS_P5: CPCIS_Connectors_P1_P6 (J6.J5), EEM_Connectors (R150.1)
BP_IO.LVDS_P6: CPCIS_Connectors_P1_P6 (J6.G5), EEM_Connectors (R151.1)
BP_IO.LVDS_P7: CPCIS_Connectors_P1_P6 (J6.E6), EEM_Connectors (R152.1)
BP_IO.LVDS_P8: CPCIS_Connectors_P1_P6 (J6.B6), EEM_Connectors (R5.1)
BP_IO.LVDS_P9: CPCIS_Connectors_P1_P6 (J6.K6), EEM_Connectors (R6.1)
BP_IO.LVDS_P10: CPCIS_Connectors_P1_P6 (J6.H6), EEM_Connectors (R7.1)
BP_IO.LVDS_P11: CPCIS_Connectors_P1_P6 (J7.D1), EEM_Connectors (R156.1)
BP_IO.LVDS_P12: CPCIS_Connectors_P1_P6 (J7.A1), EEM_Connectors (R157.1)
BP_IO.LVDS_P13: CPCIS_Connectors_P1_P6 (J7.J1), EEM_Connectors (R158.1)
BP_IO.LVDS_P14: CPCIS_Connectors_P1_P6 (J7.G1), EEM_Connectors (R159.1)
BP_IO.LVDS_P15: CPCIS_Connectors_P1_P6 (J6.E2), EEM_Connectors (R143.2)
EEM0_I2C.SCL: DIOT_tester (IC10.18), EEM_Connectors (6 pins), USB_ISOL (IC19.9 IC19.10)
EEM0_I2C.SDA: DIOT_tester (IC10.19), EEM_Connectors (6 pins), USB_ISOL (IC19.2 IC19.3)
i_adc: DIOT_tester (IC7.3), Power_Supplies (C3.2 R13.1), LED_bargraph (8 pins)
NetC2_2: DIOT_tester (IC9.3), Power_Supplies (C2.2 R11.2 R12.1)
NetIC9_4: DIOT_tester (IC9.4 IC10.15 R23.2), Power_Supplies (IC21.1 IC22.1 IC33.1)
NetIC9_5: DIOT_tester (IC9.5 IC10.16 R24.2), Power_Supplies (IC21.2 IC22.2 IC33.2)
NetIC10_5: DIOT_tester (IC10.5 R17.2), U_Heater_Thermometer8 (IC11I.1), U_Heater_Thermometer9 (IC11J.1), U_Heater_Thermometer10 (IC11K.1), U_Heater_Thermometer11 (IC11L.1), U_Heater_Thermometer12 (IC11M.1), U_Heater_Thermometer13 (IC11N.1), U_Heater_Thermometer14 (IC11O.1), U_Heater_Thermometer15 (IC11P.1)
NetIC10_6: DIOT_tester (IC10.6 R18.2), U_Heater_Thermometer8 (IC11I.2), U_Heater_Thermometer9 (IC11J.2), U_Heater_Thermometer10 (IC11K.2), U_Heater_Thermometer11 (IC11L.2), U_Heater_Thermometer12 (IC11M.2), U_Heater_Thermometer13 (IC11N.2), U_Heater_Thermometer14 (IC11O.2), U_Heater_Thermometer15 (IC11P.2)
NetIC10_8: DIOT_tester (IC10.8 R19.2), U_Heater_Thermometer0 (IC11A.1), U_Heater_Thermometer1 (IC11B.1), U_Heater_Thermometer2 (IC11C.1), U_Heater_Thermometer3 (IC11D.1), U_Heater_Thermometer4 (IC11E.1), U_Heater_Thermometer5 (IC11F.1), U_Heater_Thermometer6 (IC11G.1), U_Heater_Thermometer7 (IC11H.1)
NetIC10_9: DIOT_tester (IC10.9 R20.2), U_Heater_Thermometer0 (IC11A.2), U_Heater_Thermometer1 (IC11B.2), U_Heater_Thermometer2 (IC11C.2), U_Heater_Thermometer3 (IC11D.2), U_Heater_Thermometer4 (IC11E.2), U_Heater_Thermometer5 (IC11F.2), U_Heater_Thermometer6 (IC11G.2), U_Heater_Thermometer7 (IC11H.2)
PE_CLK.CLK_N: CPCIS_Connectors_P1_P6 (J6.F4), CLK_GEN (TR1.1)
PE_CLK.CLK_P: CPCIS_Connectors_P1_P6 (J6.E4), CLK_GEN (TR1.3)
PGOOD: Power_Supplies (IC1.7), CPCIS_Connectors_P1_P6 (R40.1 T2.1)
PSU_EN: DIOT_tester (R16.2 T5.1), Power_Supplies (IC1.8 R187.1 R188.2), CPCIS_Connectors_P1_P6 (R33.2), U_Heater_Thermometer0 (IC11A.3), U_Heater_Thermometer1 (IC11B.3), U_Heater_Thermometer2 (IC11C.3), U_Heater_Thermometer3 (IC11D.3), U_Heater_Thermometer4 (IC11E.3), U_Heater_Thermometer5 (IC11F.3), U_Heater_Thermometer6 (IC11G.3), U_Heater_Thermometer7 (IC11H.3), U_Heater_Thermometer8 (IC11I.3), U_Heater_Thermometer9 (IC11J.3), U_Heater_Thermometer10 (IC11K.3), U_Heater_Thermometer11 (IC11L.3), U_Heater_Thermometer12 (IC11M.3), U_Heater_Thermometer13 (IC11N.3), U_Heater_Thermometer14 (IC11O.3), U_Heater_Thermometer15 (IC11P.3)
PWM0: DIOT_tester (IC5.3), U_Heater_Thermometer0 (R29A.2 T6A.1)
PWM1: DIOT_tester (IC5.4), U_Heater_Thermometer1 (R29B.2 T6B.1)
PWM2: DIOT_tester (IC5.5), U_Heater_Thermometer2 (R29C.2 T6C.1)
PWM3: DIOT_tester (IC5.6), U_Heater_Thermometer3 (R29D.2 T6D.1)
PWM4: DIOT_tester (IC5.7), U_Heater_Thermometer4 (R29E.2 T6E.1)
PWM5: DIOT_tester (IC5.8), U_Heater_Thermometer5 (R29F.2 T6F.1)
PWM6: DIOT_tester (IC5.9), U_Heater_Thermometer6 (R29G.2 T6G.1)
PWM7: DIOT_tester (IC5.10), U_Heater_Thermometer7 (R29H.2 T6H.1)
PWM8: DIOT_tester (IC5.12), U_Heater_Thermometer8 (R29I.2 T6I.1)
PWM9: DIOT_tester (IC5.13), U_Heater_Thermometer9 (R29J.2 T6J.1)
PWM10: DIOT_tester (IC5.14), U_Heater_Thermometer10 (R29K.2 T6K.1)
PWM11: DIOT_tester (IC5.15), U_Heater_Thermometer11 (R29L.2 T6L.1)
PWM12: DIOT_tester (IC5.16), U_Heater_Thermometer12 (R29M.2 T6M.1)
PWM13: DIOT_tester (IC5.17), U_Heater_Thermometer13 (R29N.2 T6N.1)
PWM14: DIOT_tester (IC5.18), U_Heater_Thermometer14 (R29O.2 T6O.1)
PWM15: DIOT_tester (IC5.19), U_Heater_Thermometer15 (R29P.2 T6P.1)
SERVMOD_3V3: CPCIS_Connectors_P1_P6 (R69.2 R138.1), EEM_Connectors (IC40.5 IC40.6 IC40.12 IC40.13)